# EAGLE design soil moisture v1 (EAGLE 9.7.0)
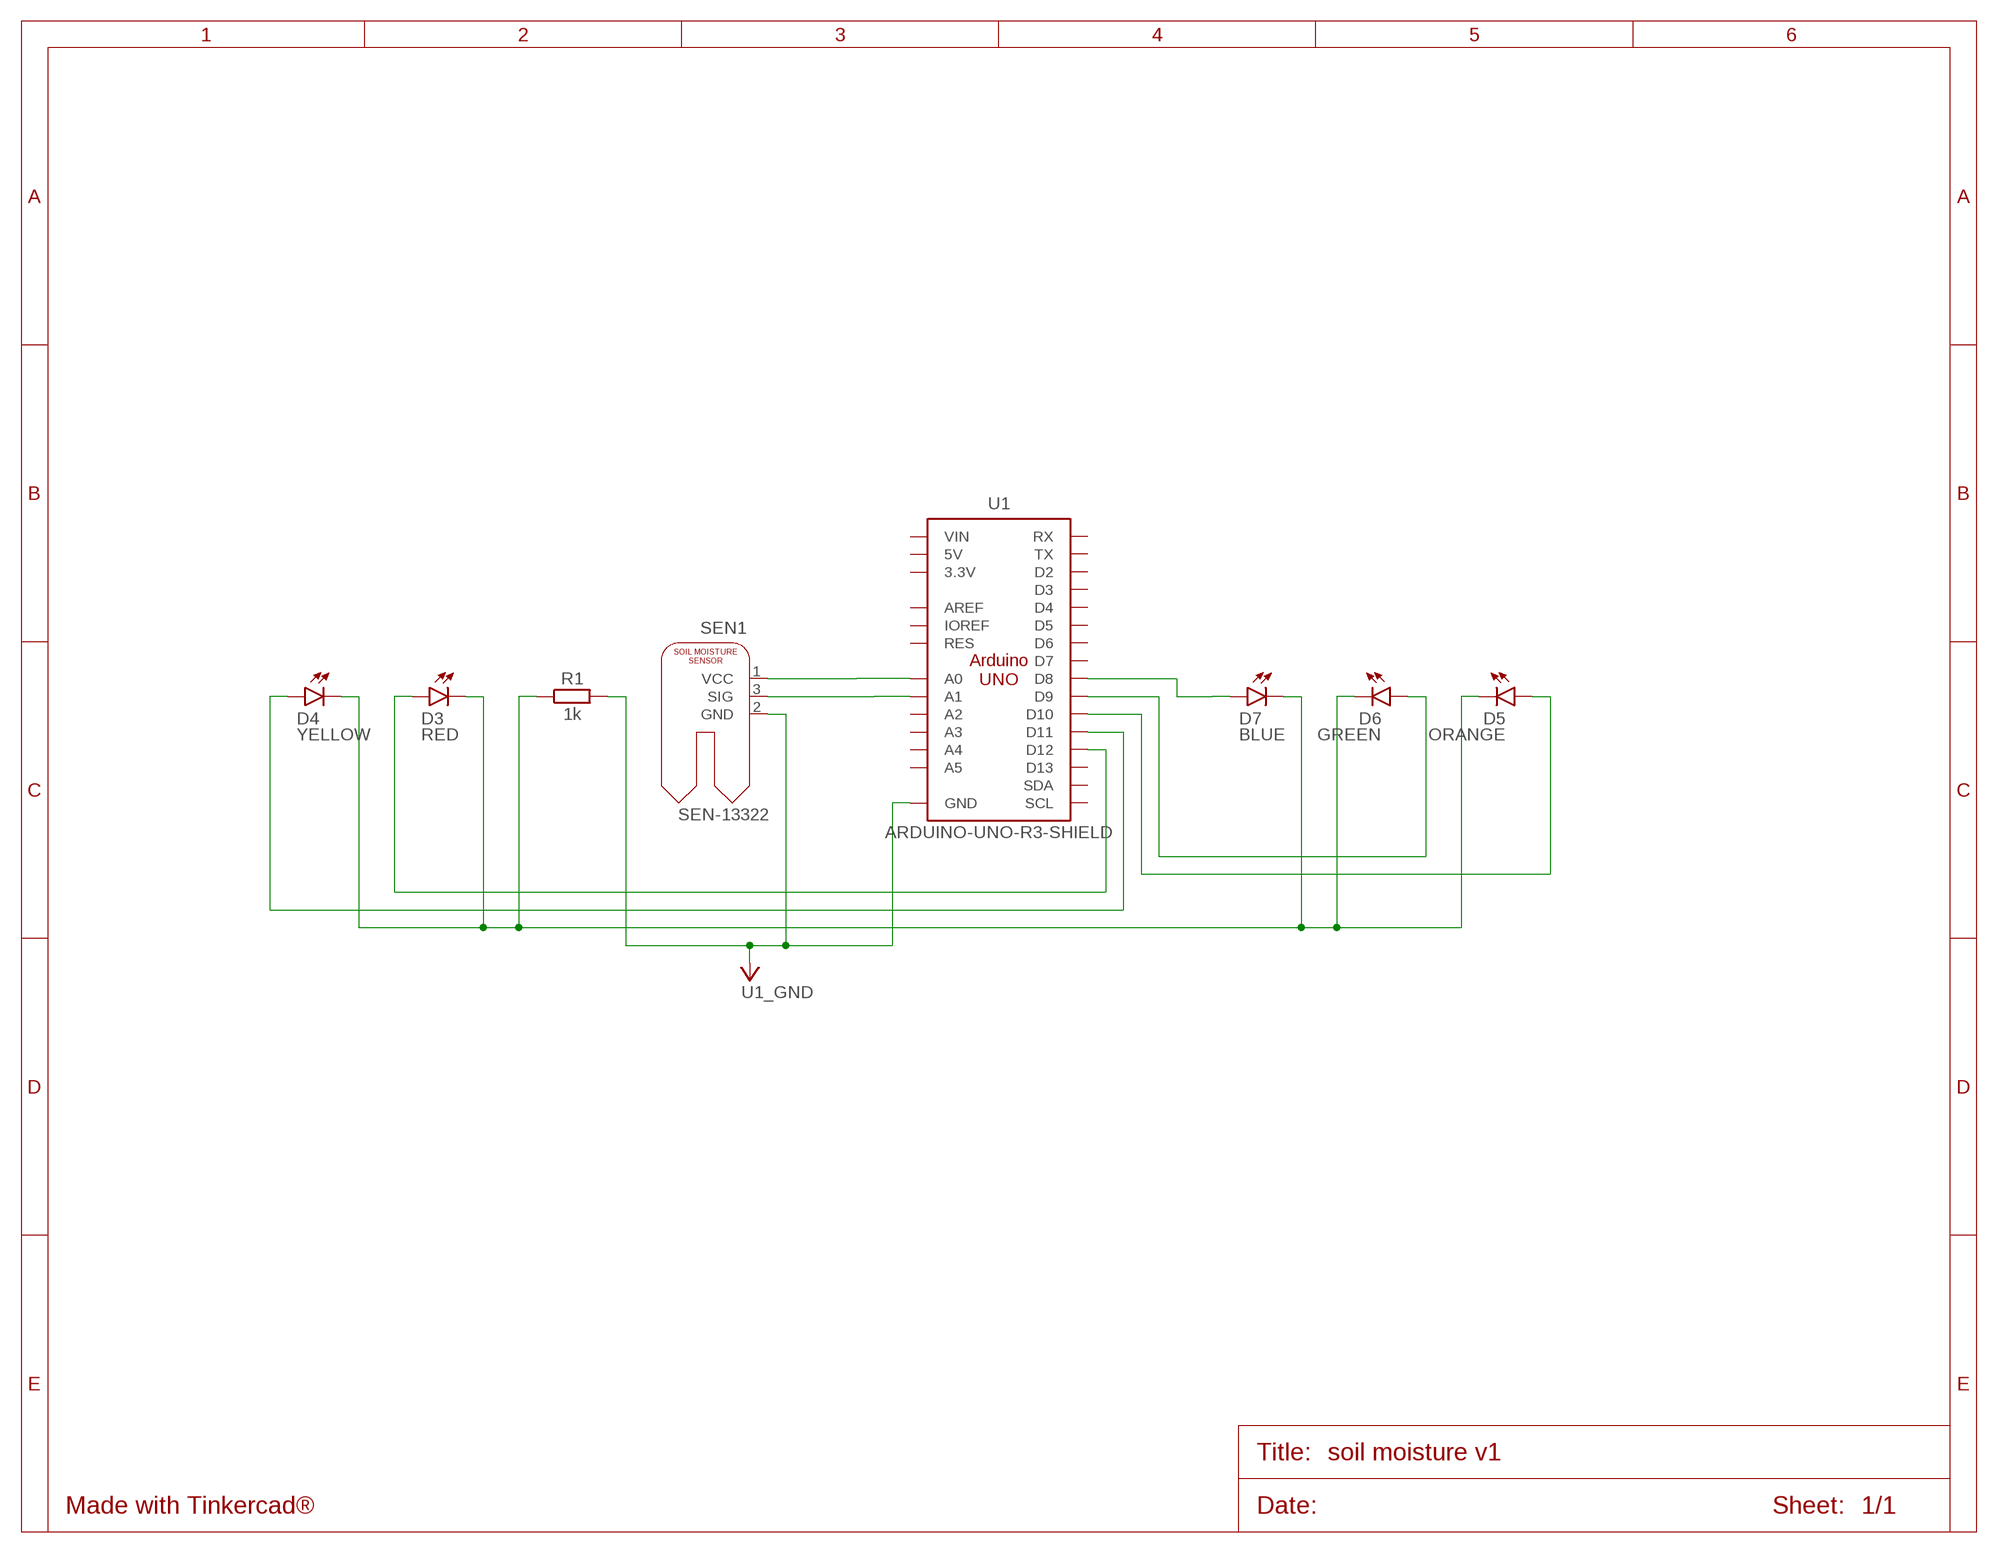
[diagram p0: schematic, sheet 1]

## Parts
D3  RED  LED_RADIAL_RED  [LEDRD254W60D565H860B]
D4  YELLOW  LED_RADIAL_YELLOW  [LEDRD254W60D565H860B_Y]
D5  ORANGE  LED_RADIAL_ORANGE  [LEDRD254W60D565H860B_O]
D6  GREEN  LED_RADIAL_GREEN  [LEDRD254W60D565H860B_G]
D7  BLUE  LED_RADIAL_BLUE  [LEDRD254W60D565H860B_B]
R1  1k  RESISTOR_AXIAL-10.16MM-PITCH  [RESAD1016W63L850D250B]
SEN1  SEN-13322  [SEN-13322]
U1  ARDUINO-UNO-R3-SHIELD  [ARDUINO-UNO-R3-SHIELD]

## Nets
D3_C: D3.2(C) D4.2(C) D5.2(C) D6.2(C) D7.2(C) R1.1
U1_A0: SEN1.1(VCC) U1.A0
U1_A1: SEN1.3(SIG) U1.A1
U1_D8: D7.1(A) U1.D8
U1_D9: D6.1(A) U1.D9
U1_D10: D5.1(A) U1.D10
U1_D11: D4.1(A) U1.D11
U1_D12: D3.1(A) U1.D12
U1_GND: R1.2 SEN1.2(GND) U1.GND@0(GND) U1.GND@1(GND) U1.GND@2(GND)
Unconnected: U1.3.3V U1.5V U1.A2 U1.A3 U1.A4 U1.A5 U1.AREF U1.D2 U1.D3 U1.D4 U1.D5 U1.D6 U1.D7 U1.D13 U1.IOREF U1.RES U1.RX U1.SCL U1.SDA U1.TX U1.VIN

## Library data of the parts
D3 = Tinkercad:LED_RADIAL: LED - Generic; CATEGORY: Opto-Electronic; SUB-CATEGORY: LED; VALUE: LED_RED
D4 = Tinkercad:LED_RADIAL: LED - Generic; CATEGORY: Opto-Electronic; SUB-CATEGORY: LED; VALUE: LED_YELLOW
D5 = Tinkercad:LED_RADIAL: LED - Generic; CATEGORY: Opto-Electronic; SUB-CATEGORY: LED; VALUE: LED_ORANGE
D6 = Tinkercad:LED_RADIAL: LED - Generic; CATEGORY: Opto-Electronic; SUB-CATEGORY: LED; VALUE: LED_GREEN
D7 = Tinkercad:LED_RADIAL: LED - Generic; CATEGORY: Opto-Electronic; SUB-CATEGORY: LED; VALUE: LED_BLUE
R1 = Tinkercad:RESISTOR: Resistor Fixed - Generic
SEN1 = Tinkercad:SEN-13322
U1 = Tinkercad:ARDUINO-UNO-R3-SHIELD

## Board
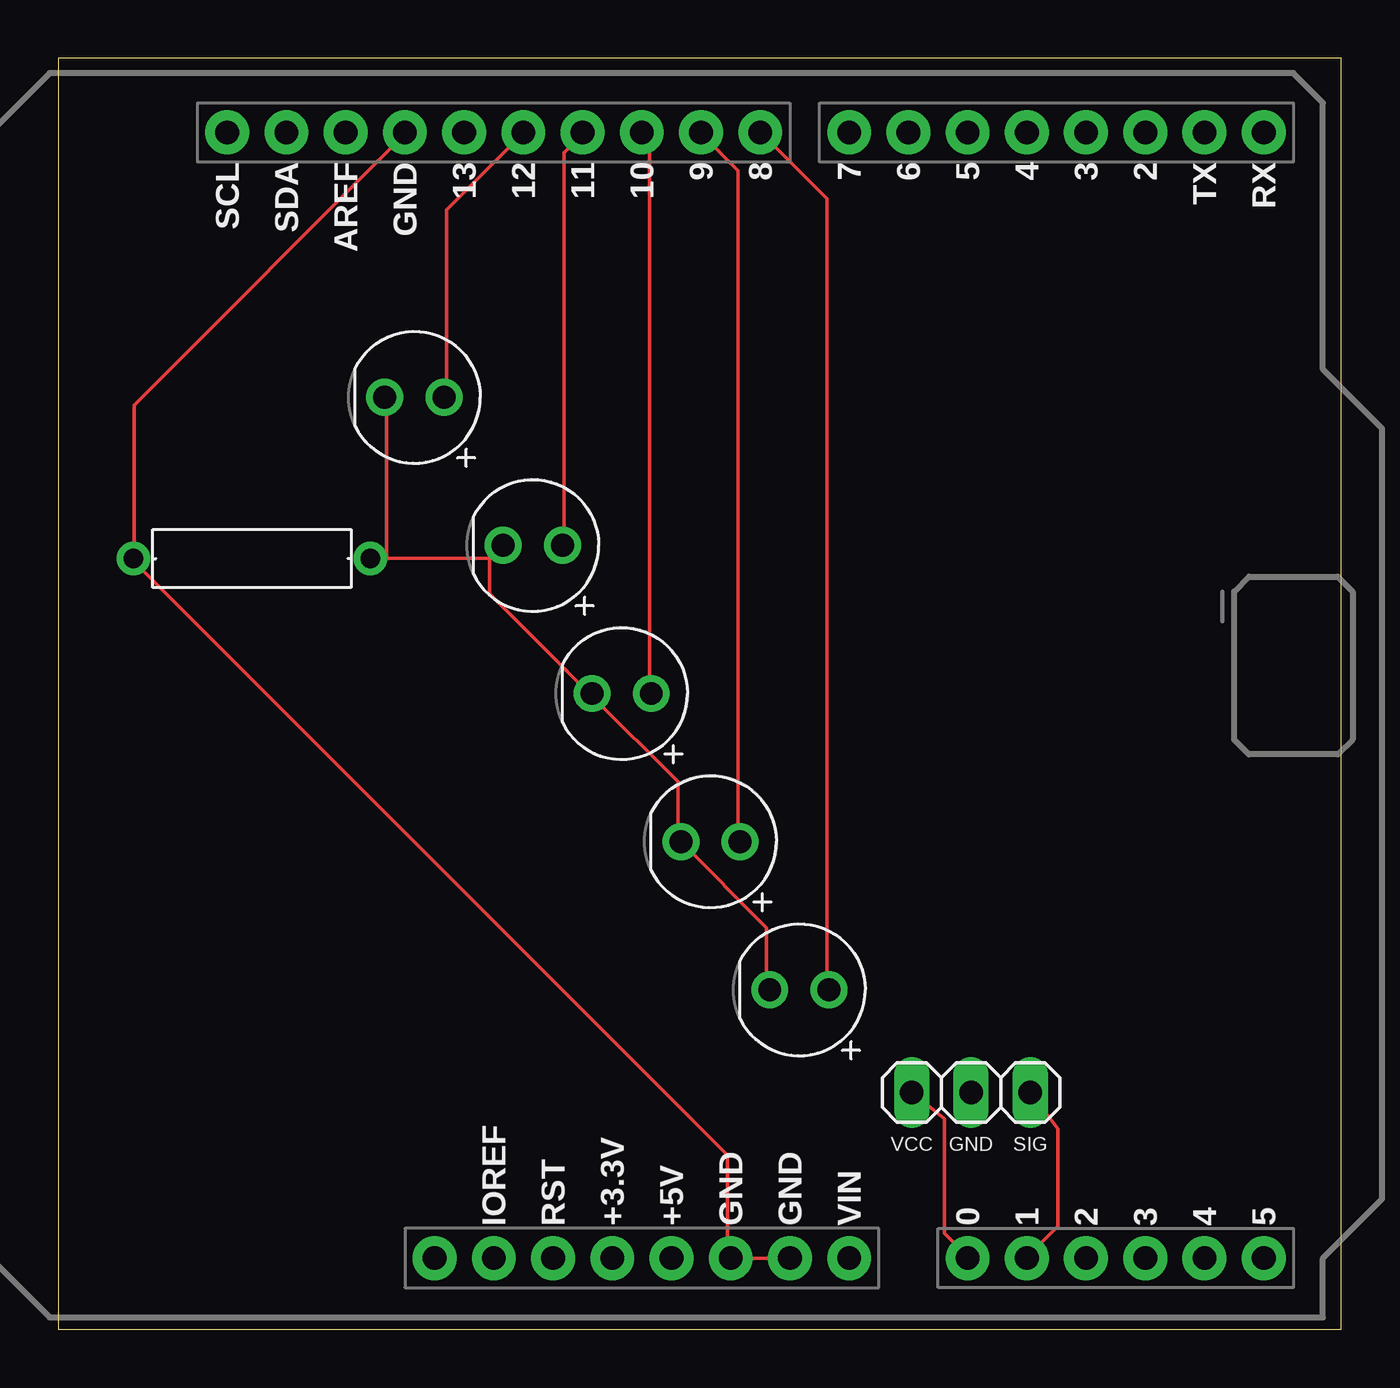
[diagram p1: board, top side]
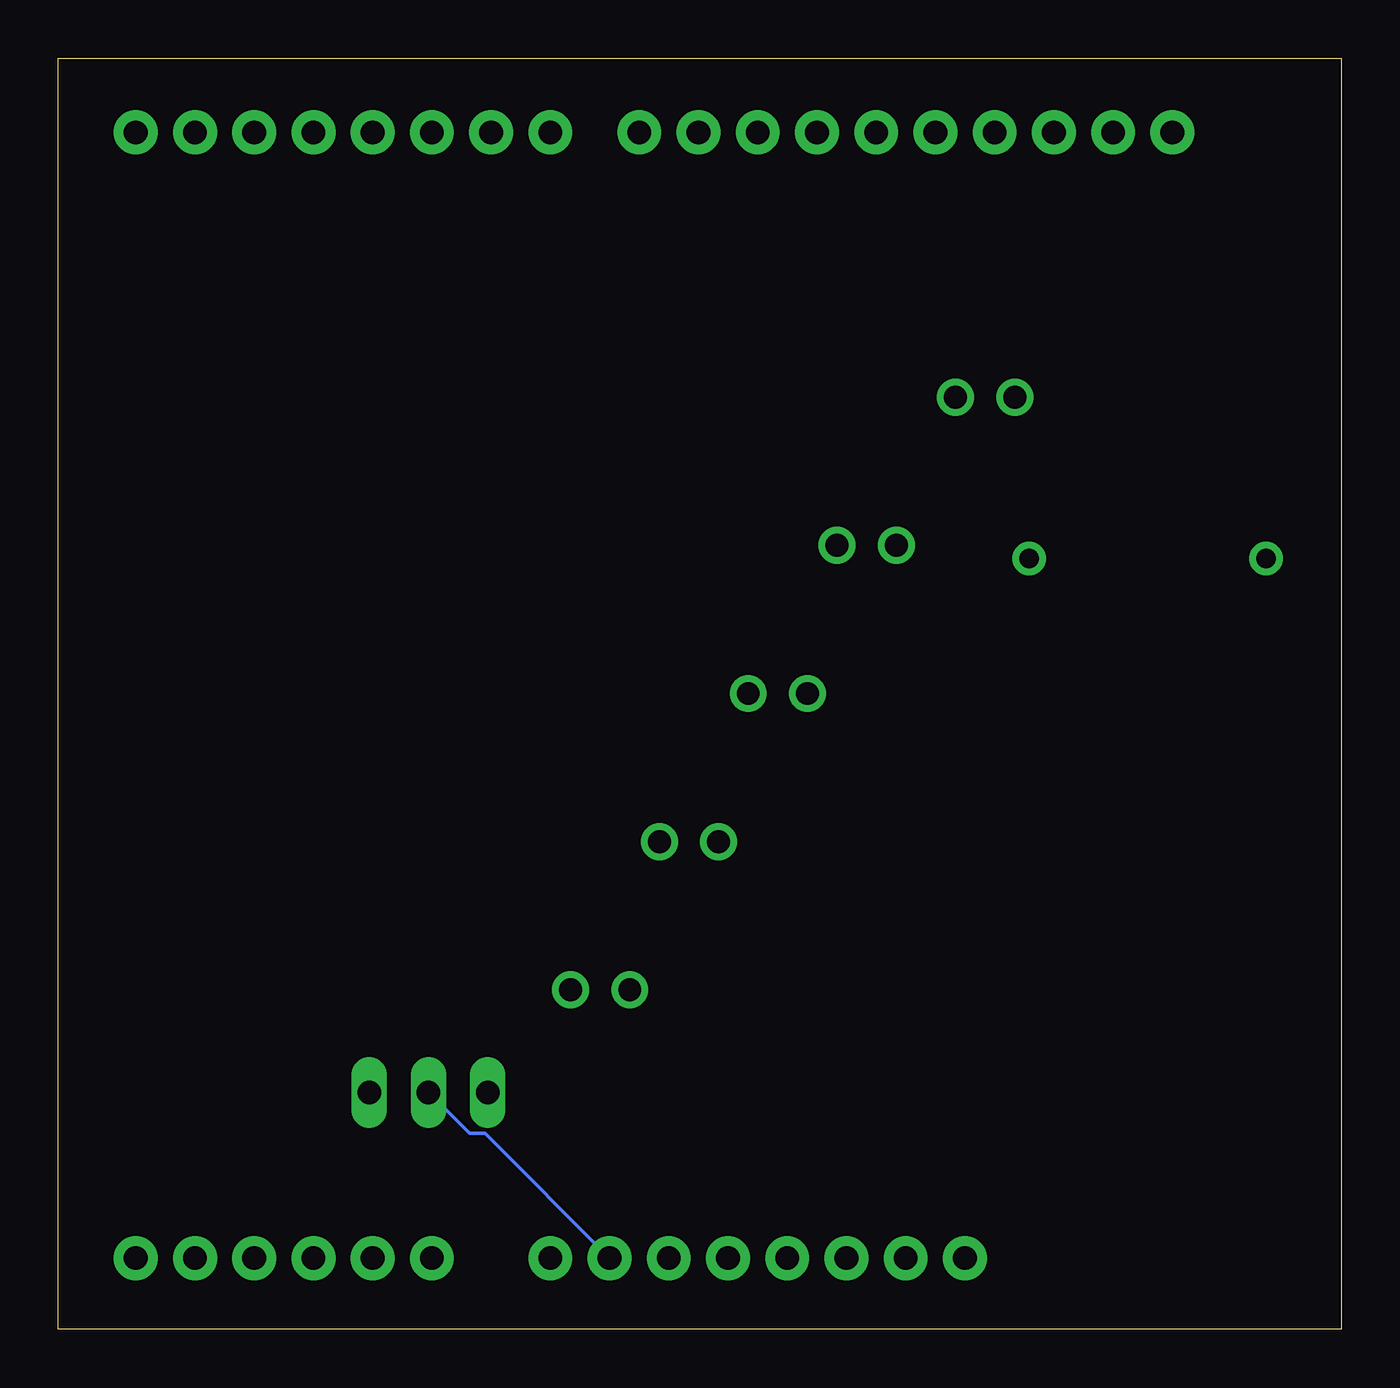
[diagram p2: board, bottom side, seen from below]

Size 55.02 x 54.49 mm. Coordinates in mm from the lower left corner, seen from the top.
Outline: 0,0 55.02,0 55.02,54.49 0,54.49 0,0
Copper layers (1*16): Top 0.035mm / dielectric 1.5mm / Bottom 0.035mm
Design rules "default": minimum track width 6mil, minimum drill 0.35mm, track to track 6mil, track to pad 6mil, pad to pad 6mil, via to via 6mil, smd to smd 6mil, copper to edge 40mil, drill to drill 6mil, minimum pad ring 10mil, minimum via ring 8mil, stop-mask expansion 4mil, vias tented up to drill 0mil, thermal gap 10mil

### Footprints (pad centres in the part's own frame; a part is rotated, then mirrored left to right if it is on the bottom)
LEDRD254W60D565H860B = drill 0.981 pad 1.581: 1 -1.27,0; 2 1.27,0
LEDRD254W60D565H860B_Y = drill 0.981 pad 1.581: 1 -1.27,0; 2 1.27,0
LEDRD254W60D565H860B_O = drill 0.981 pad 1.581: 1 -1.27,0; 2 1.27,0
LEDRD254W60D565H860B_G = drill 0.981 pad 1.581: 1 -1.27,0; 2 1.27,0
LEDRD254W60D565H860B_B = drill 0.981 pad 1.581: 1 -1.27,0; 2 1.27,0
RESAD1016W63L850D250B = drill 0.83 pad 1.43: 1 -5.08,0; 2 5.08,0
SEN-13322 = drill 1.016 long: 1 -2.54,0; 2 0,0; 3 2.54,0
ARDUINO-UNO-R3-SHIELD = drill 1.016 pad 1.88: 3.3V 24.13,-2.54; 5V 24.13,0; A0 24.13,12.7; A1 24.13,15.24; A2 24.13,17.78; A3 24.13,20.32; A4 24.13,22.86; A5 24.13,25.4; AREF -24.13,-13.97; D2 -24.13,20.32; D3 -24.13,17.78; D4 -24.13,15.24; D5 -24.13,12.7; D6 -24.13,10.16; D7 -24.13,7.62; D8 -24.13,3.81; D9 -24.13,1.27; D10 -24.13,-1.27; D11 -24.13,-3.81; D12 -24.13,-6.35; D13 -24.13,-8.89; GND@0 24.13,2.54; GND@1 24.13,5.08; GND@2 -24.13,-11.43; IOREF 24.13,-7.62; NC 24.13,-10.16; RES 24.13,-5.08; RX -24.13,25.4; SCL -24.13,-19.05; SDA -24.13,-16.51; TX -24.13,22.86; VIN 24.13,7.62

### Placement (x,y rotation side)
D3  15.27,39.96 180 top
D4  20.35,33.61 180 top
D5  24.16,27.26 180 top
D6  27.97,20.91 180 top
D7  31.78,14.56 180 top
R1  8.3,33.05 180 top
SEN1  39.14,10.16 0 top
U1  26.29,27.19 270 top

### Tracks (layer width: path | path; a pad name or v marks a point on that pad's centre or on a via)
D3_C
  Top 0.152: 18.49,33.07 14.07,33.07 | 14.07,33.07 13.46,33.07 R1.1 14.07,33.07 | 18.49,33.07 18.95,33.53 D4.2 | 14.07,33.07 14.07,39.93 D3.2 | D7.2 30.38,14.63 30.38,17.22 26.72,20.88 D6.2 26.57,21.03 26.57,23.47 22.91,27.13 D5.2 22.76,27.28 18.49,31.55 18.49,33.07
U1_A0
  Top 0.152: SEN1.1 38,9.03 38,4.11 38.91,3.2 U1.A0
U1_A1
  Top 0.152: SEN1.3 42.88,8.61 42.88,4.42 41.66,3.2 U1.A1
U1_D8
  Top 0.152: D7.1 32.97,14.63 32.97,48.46 30.23,51.21 U1.D8
U1_D9
  Top 0.152: D6.1 29.16,21.03 29.16,49.68 27.64,51.21 U1.D9
U1_D10
  Top 0.152: D5.1 25.35,27.28 25.35,50.9 25.04,51.21 U1.D10
U1_D11
  Top 0.152: D4.1 21.69,33.68 21.69,50.44 22.45,51.21 U1.D11
U1_D12
  Top 0.152: D3.1 16.66,40.08 16.66,48.01 19.86,51.21 U1.D12
U1_GND
  Top 0.152: U1.GND@1 31.29,3.05 28.85,3.05 U1.GND@0 28.7,3.2 28.7,7.47 3.25,32.92 R1.2 3.25,33.07 3.25,39.62 14.83,51.21 U1.GND@2
  Bottom 0.152: U1.GND@1 36.72,8.41 37.39,8.41 SEN1.2